# Altium schematic sheet Lobbyist.SchDoc
size E
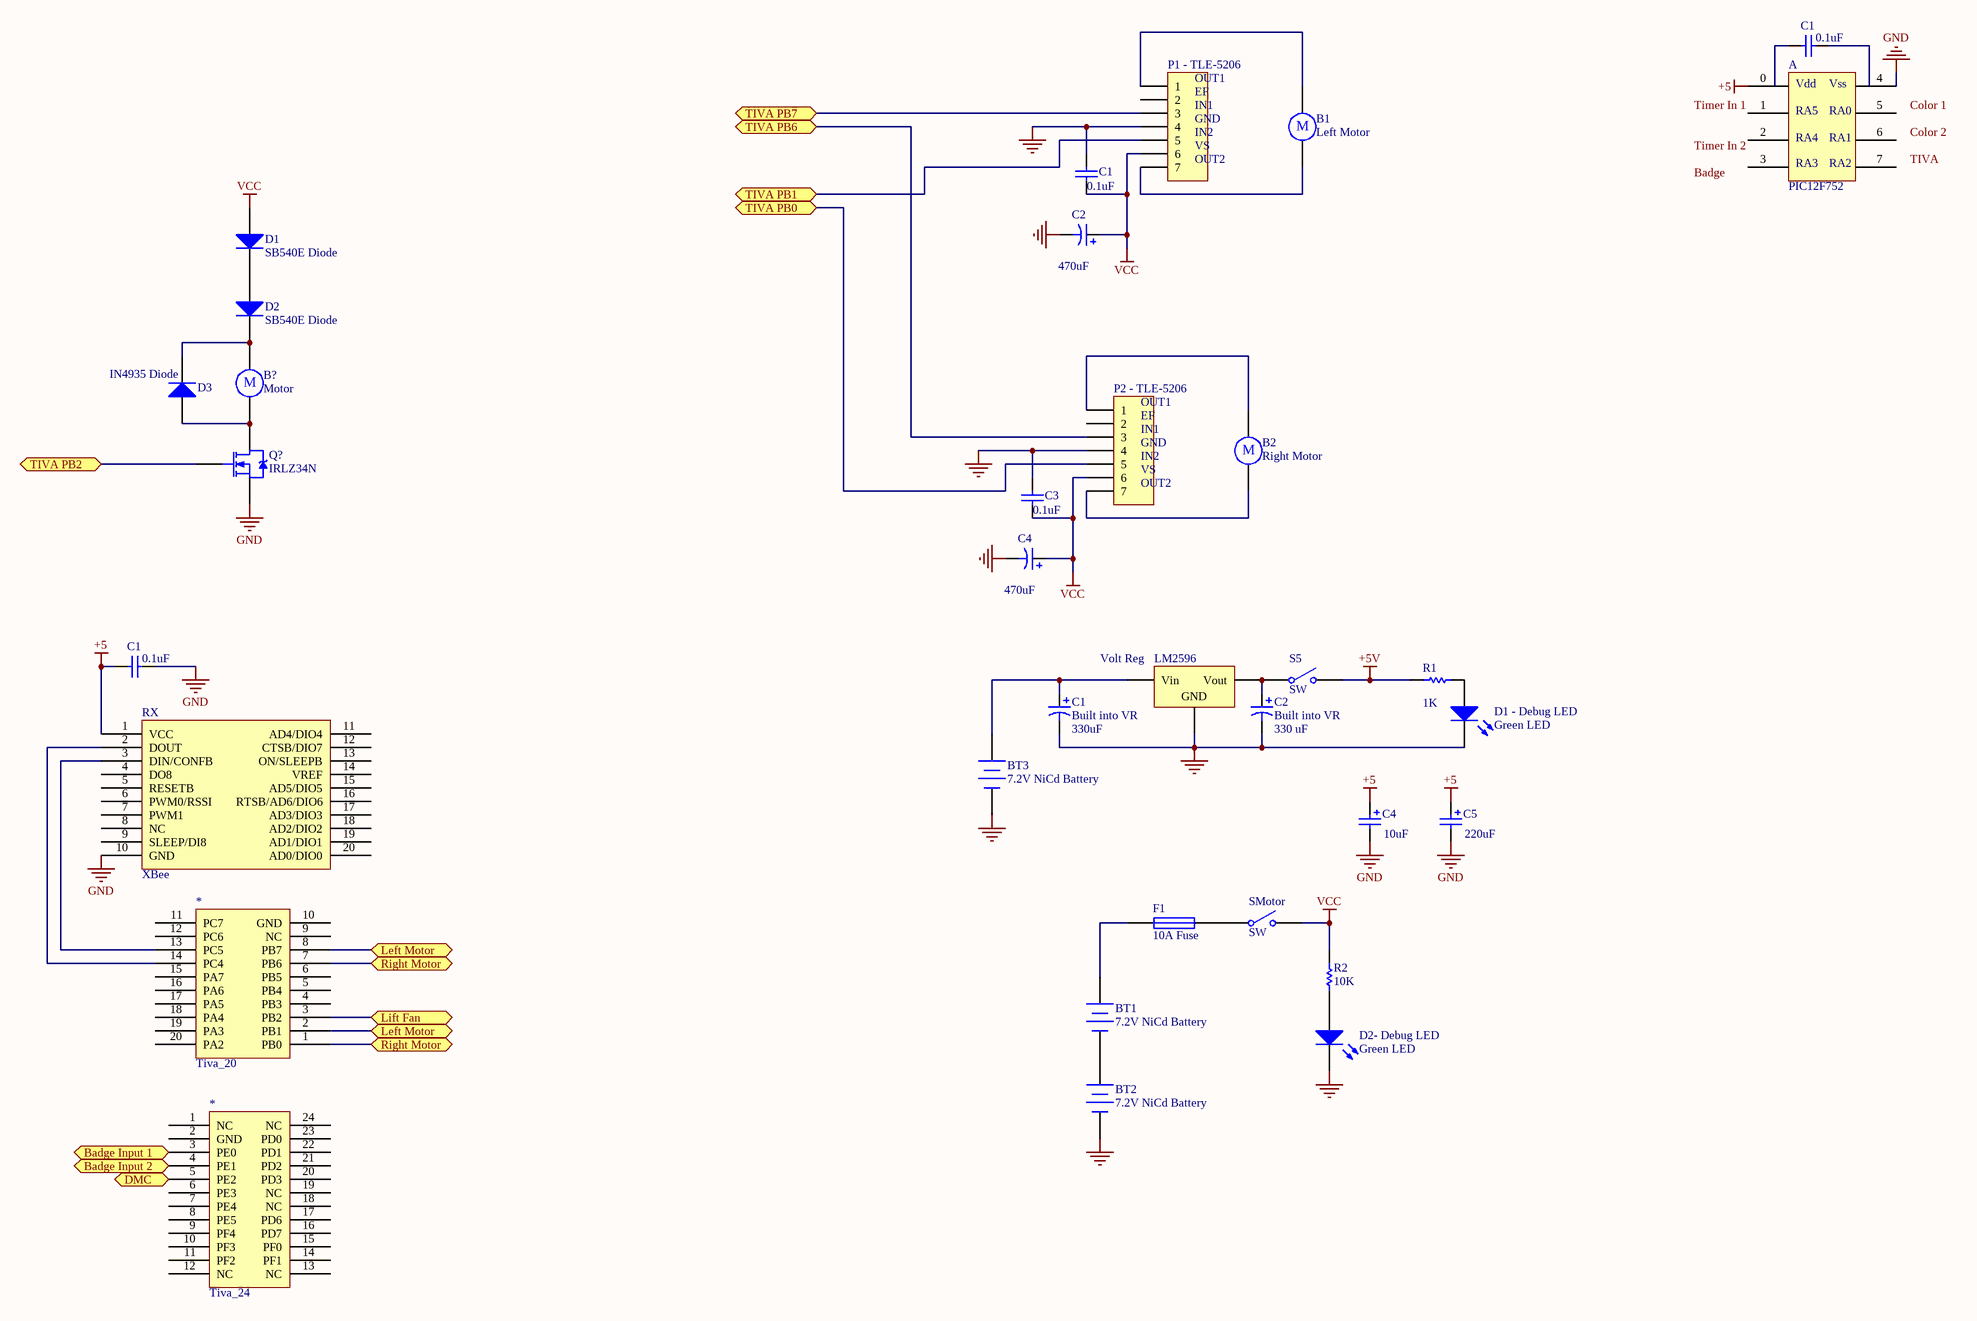
[diagram p0: Lobbyist.SchDoc]

## Parts
(Parts that share a designator on the sheet are numbered #1, #2 ... from top to bottom, then left to right.)
*#1  Tiva_20
*#2  Tiva_24
A  PIC12F752
B1  Left Motor  [RB5-10.5]
B2  Right Motor  [RB5-10.5]
B?  Motor  [RB5-10.5]
BT1  7.2V NiCd Battery  [BAT-2]
BT2  7.2V NiCd Battery  [BAT-2]
BT3  7.2V NiCd Battery  [BAT-2]
C1#1  value 0.1uF  [RAD-0.3]  (hidden comment: Cap)
C1#2  value 0.1uF  [RAD-0.3]  (hidden comment: Cap)
C1#3  value 0.1uF  [RAD-0.3]  (hidden comment: Cap)
C1#4  Built into VR  value 330uF  [RB7.6-15]
C2#1  value 470uF  [RB7.6-15]  (hidden comment: Cap Pol1)
C2#2  Built into VR  value 330 uF  [RB7.6-15]
C3  value 0.1uF  [RAD-0.3]  (hidden comment: Cap)
C4#1  value 470uF  [RB7.6-15]  (hidden comment: Cap Pol1)
C4#2  value 10uF  [RB7.6-15]  (hidden comment: Cap Pol1)
C5  value 220uF  [RB7.6-15]  (hidden comment: Cap Pol1)
D1  SB540E Diode  [DSO-C2/X3.3]
D1_-_Debug_LED  Green LED  [LED-0]
D2  SB540E Diode  [DSO-C2/X3.3]
D2-_Debug_LED  Green LED  [LED-0]
D3  IN4935 Diode  [DSO-C2/X3.3]
F1  10A Fuse  [PIN-W2/E2.8]
LM2596  Volt Reg  [D2PAK_L]
P1_-_TLE-5206  Header 7  [HDR1X7]  (value not drawn)
P2_-_TLE-5206  Header 7  [HDR1X7]  (value not drawn)
Q?  IRLZ34N  [SFM-T3/A4.7V]
R1  value 1K  [AXIAL-0.3]  (hidden comment: Res1)
R2  value 10K  [AXIAL-0.3]  (hidden comment: Res1)
RX  XBee
S5  SW  [SPST-2]
SMotor  SW  [SPST-2]

## Ports
Badge Input 1, Badge Input 2, DMC, Left Motor, Lift Fan, Right Motor, TIVA PB0, TIVA PB1, TIVA PB2, TIVA PB6, TIVA PB7

## Nets
+5: C1#3.1 C4#2.1 C5.1 RX.1(VCC)
+5V: R1.2 S5.2(NO)
GND: BT2.2(-) BT3.2(-) C1#2.1 C1#3.2 C1#4.2 C2#1.2 C2#2.2 C3.1 C4#1.2 C4#2.2 C5.2 D1_-_Debug_LED.2(K) D2-_Debug_LED.2(K) LM2596.2(GND) P1_-_TLE-5206.4 P2_-_TLE-5206.4 Q?.3(S) RX.10(GND)
VCC: C1#2.2 C2#1.1 C3.2 C4#1.1 D1.1(A) P1_-_TLE-5206.6 P2_-_TLE-5206.6 R2.1 SMotor.2(NO)
Badge Input 1: *#2.3(PE0) ; port Badge Input 1
Badge Input 2: *#2.4(PE1) ; port Badge Input 2
DMC: *#2.5(PE2) ; port DMC
Left Motor: *#1.2(PB1) *#1.8(PB7) ; port Left Motor
Lift Fan: *#1.3(PB2) ; port Lift Fan
Right Motor: *#1.1(PB0) *#1.7(PB6) ; port Right Motor
TIVA PB0: P2_-_TLE-5206.5 ; port TIVA PB0
TIVA PB1: P1_-_TLE-5206.5 ; port TIVA PB1
TIVA PB2: Q?.1(G) ; port TIVA PB2
TIVA PB6: P2_-_TLE-5206.3 ; port TIVA PB6
TIVA PB7: P1_-_TLE-5206.3 ; port TIVA PB7
Net*#1_13: *#1.13(PC5) RX.3(DIN/CONFB)
Net*#1_14: *#1.14(PC4) RX.2(DOUT)
NetB1_1: B1.1 P1_-_TLE-5206.1
NetB1_2: B1.2 P1_-_TLE-5206.7
NetB2_1: B2.1 P2_-_TLE-5206.1
NetB2_2: B2.2 P2_-_TLE-5206.7
NetB?_1: B?.1 D2.2(K) D3.2(K)
NetB?_2: B?.2 D3.1(A) Q?.2(D)
NetBT1_1: BT1.1(+) F1.1
NetBT1_2: BT1.2(-) BT2.1(+)
NetBT3_1: BT3.1(+) C1#4.1 LM2596.1(Vin)
NetC2#2_1: C2#2.1 LM2596.3(Vout) S5.1(COMMON)
NetD1_2: D1.2(K) D2.1(A)
NetD1_-_Debug_LED_1: D1_-_Debug_LED.1(A) R1.1
NetD2-_Debug_LED_1: D2-_Debug_LED.1(A) R2.2
NetF1_2: F1.2 SMotor.1(COMMON)

Not connected (* = marked no-connect by the designer): *#1 4(PB3) 5(PB4) 6(PB5) 9(NC) 10(GND) 11(PC7) 12(PC6) 15(PA7) 16(PA6) 17(PA5) 18(PA4) 19(PA3) 20(PA2); *#2 1(NC) 2(GND) 6(PE3) 7(PE4) 8(PE5) 9(PF4) 10(PF3) 11(PF2) 12(NC) 13(NC) 14(PF1) 15(PF0) 16(PD7) 17(PD6) 18(NC) 19(NC) 20(PD3) 21(PD2) 22(PD1) 23(PD0) 24(NC); A 0 1 2 3 4 5 6 7; C1#1 1 2; P1_-_TLE-5206 2; P2_-_TLE-5206 2; RX 4(DO8) 5(RESETB) 6(PWM0/RSSI) 7(PWM1) 8(NC) 9(SLEEP/DI8) 11(AD4/DIO4) 12(CTSB/DIO7) 13(ON/SLEEPB) 14(VREF) 15(AD5/DIO5) 16(RTSB/AD6/DIO6) 17(AD3/DIO3) 18(AD2/DIO2) 19(AD1/DIO1) 20(AD0/DIO0)

## Notes on the sheet
- Labels drawn without touching a wire or pin: +5, Badge, Color 1, Color 2, Timer In 1, Timer In 2, TIVA
- (in symbol Header 7) OUT1; EF; IN1; GND; IN2; VS; OUT2
- (in symbol Motor) M
- (in symbol PIC12F752) Vdd; Vss; RA5; RA0; RA4; RA1; RA3; RA2

## Library data of the parts
*#1 = Tiva_20: Tiva Protection 20 Pin Connector
*#2 = Tiva_24: Tiva Protection 24 Pin Connector
B1 B2 B? = Motor: Motor, General Kind; Manufacturer: Generic Components; Published: 1999
BT1-BT3 = Battery: Multicell Battery; Published: 24-Mar-1999; LatestRevisionDate: 17-Jul-2002; LatestRevisionNote: Re-released for DXP Platform.; PackageReference: BAT-2; Publisher: Altium Limited; PackageDescription: Battery; 2 Leads
C1#1-C1#3 C3 = Cap: Capacitor; Published: 8-Jun-2000; LatestRevisionDate: 17-Jul-2002; LatestRevisionNote: Re-released for DXP Platform.; PackageReference: RAD-0.3; Publisher: Altium Limited; PackageDescription: Radial Cap, Thru-Hole; 2 Leads; 0.3 in Pin Spacing
C1#4 C2#1 C2#2 C4#1 = Cap Pol1: Polarized Capacitor (Radial); Published: 8-Jun-2000; LatestRevisionDate: 17-Jul-2002; LatestRevisionNote: Re-released for DXP Platform.; PackageReference: RB7.6-15; Publisher: Altium Limited; PackageDescription: Polarized Capacitor (Radial); 2 Leads
C4#2 C5 = Cap Pol1: Polarized Capacitor (Radial); Manufacturer: Generic Components; Class: Passive; Published: 08/06/2000; Publisher: Altium Hobart Technology Centre; SubClass: Capacitor
D1-D3 = Diode: Default Diode; Manufacturer: Generic Components; Class: Discrete; SubClass: Diode - Switching; Published: 08/06/2000; Publisher: Altium Hobart Technology Centre
D1_-_Debug_LED D2-_Debug_LED = LED0: Typical INFRARED GaAs LED; Published: 8-Jun-2000; LatestRevisionDate: 08-Jul-2005; LatestRevisionNote: Mech Layer 1 removed.; PackageReference: LED-0; Publisher: Altium Limited; PackageDescription: LED; 2 Leads
F1 = Fuse 1: Fuse; Published: 8-Jun-2000; LatestRevisionDate: 17-Jul-2002; LatestRevisionNote: Re-released for DXP Platform.; PackageReference: PIN-W2/E2.8; Publisher: Altium Limited; PackageDescription: Thru-Hole; 2 Leads
LM2596 = Volt Reg: Voltage Regulator; Published: 24-Mar-1999; LatestRevisionDate: 29-May-2009; LatestRevisionNote: IPC-7351 Footprint Added.; PackageReference: D2PAK; Publisher: Altium Limited; PackageDescription: 3-Pin Transistor Outline Package 2.54 mm Pitch, 15.1 mm Lead Span
P1_-_TLE-5206 P2_-_TLE-5206 = Header 7: Header, 7-Pin; LatestRevisionDate: 17-Jul-2002; LatestRevisionNote: Re-released for DXP Platform.; Publisher: Altium Limited
Q? = IRLZ34N: HEXFET Power MOSFET; Manufacturer: International Rectifier; Class: Discrete; SubClass: MOSFET - Power; Note: Pin 2 is electrically connected to pin 4.; Published: 8/06/2000; Publisher: Altium Hobart Technology Centre
R1 R2 = Res1: Resistor; Published: 8-Jun-2000; LatestRevisionDate: 17-Jul-2002; LatestRevisionNote: Re-released for DXP Platform.; PackageReference: AXIAL-0.3; Publisher: Altium Limited; PackageDescription: Axial Device, Thru-Hole; 2 Leads; 0.3 in Pin Spacing
S5 SMotor = SW-SPST: Single-Pole, Single-Throw Switch; Published: 24-Mar-1999; LatestRevisionDate: 17-Jul-2002; LatestRevisionNote: Re-released for DXP Platform.; PackageReference: SPST-2; Publisher: Altium Limited; PackageDescription: Switch; 2 Leads